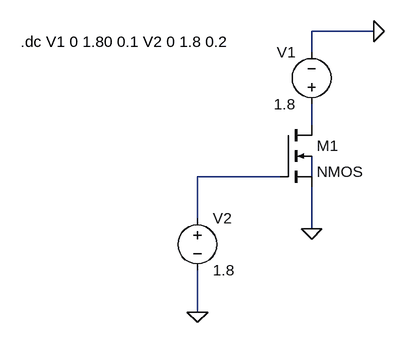
[diagram p0: schematic NMOSvtc.asc]
NMOSvtc.asc, the LTspice schematic file:
Version 4
SHEET 1 880 680
WIRE 272 64 176 64
WIRE 176 96 176 64
WIRE 176 208 176 176
WIRE 128 288 0 288
WIRE 176 288 176 256
WIRE 0 352 0 288
WIRE 176 368 176 304
WIRE 0 496 0 432
FLAG 0 496 0
FLAG 176 368 0
FLAG 272 64 0
SYMBOL voltage 176 192 R180
WINDOW 0 24 96 Left 2
WINDOW 3 24 16 Left 2
WINDOW 123 0 0 Left 0
WINDOW 39 0 0 Left 0
SYMATTR InstName V1
SYMATTR Value 1.8
SYMBOL voltage 0 336 R0
WINDOW 123 0 0 Left 0
WINDOW 39 0 0 Left 0
SYMATTR InstName V2
SYMATTR Value 1.8
SYMBOL nmos4 128 208 R0
SYMATTR InstName M1
SYMATTR Value2 l=1080nm w=1080nm
TEXT -272 80 Left 2 !.dc V1 0 1.80 0.1 V2 0 1.8 0.2

The netlist it stands for:
* NMOSvtc.asc
V1 N001 0 1.8
V2 N002 0 1.8
M1 N001 N002 0 N003 NMOS l=1080nm w=1080nm
.model NMOS NMOS
.model PMOS PMOS
.lib standard.mos
.dc V1 0 1.80 0.1 V2 0 1.8 0.2
.backanno
.end